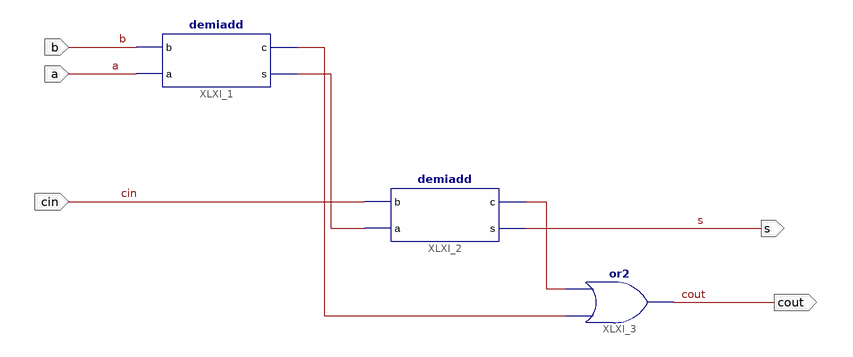
[diagram p0: schematic sheet 1]
// Xilinx ISE schematic add1bit.sch (spartan3e) as structural Verilog: 3 symbols, 5 ports
module add1bit (
  input  b,
  input  a,
  input  cin,
  output s,
  output cout
);

  wire XLXN_4, XLXN_5, XLXN_6;

  demiadd XLXI_1 (.b(b), .a(a), .c(XLXN_6), .s(XLXN_4));
  demiadd XLXI_2 (.b(cin), .a(XLXN_4), .c(XLXN_5), .s(s));
  or XLXI_3 (cout, XLXN_6, XLXN_5);
endmodule
